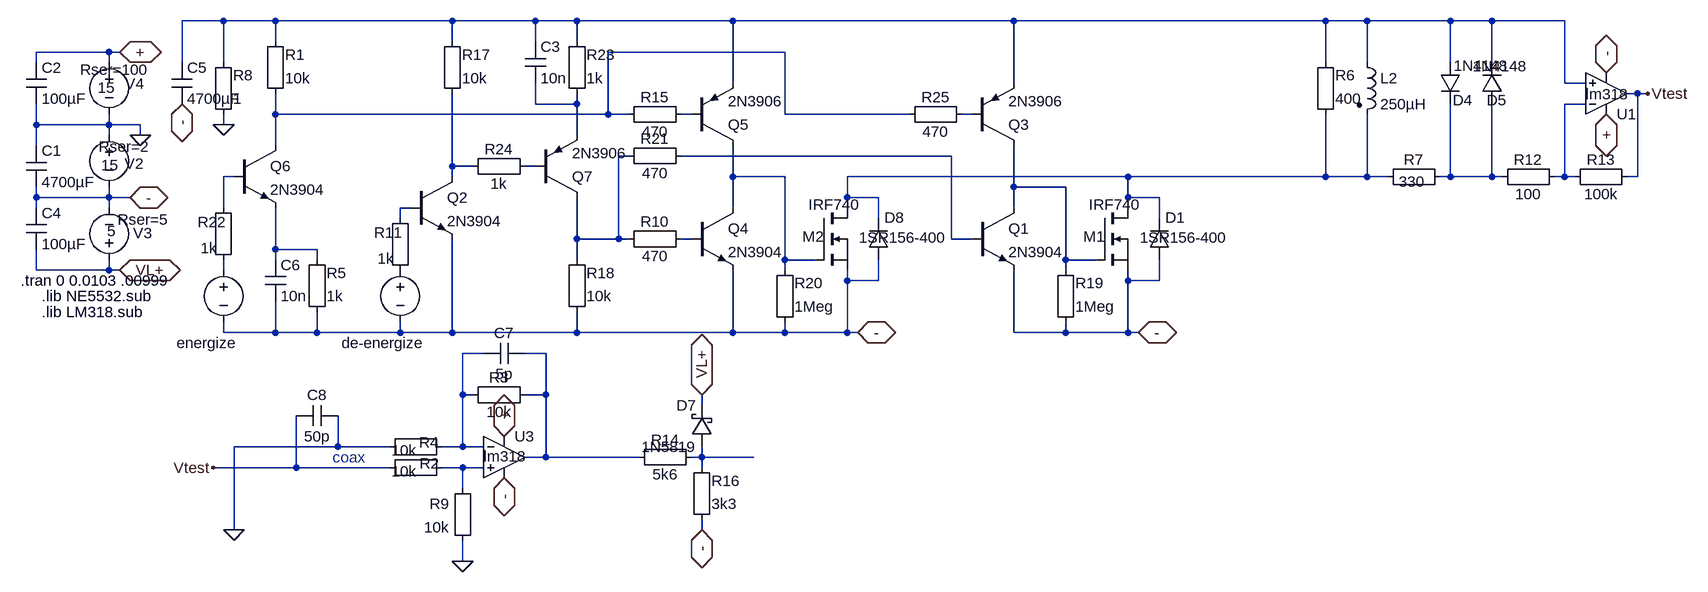
[diagram p0: schematic metal_low_power_fast_switch_4080.asc]
metal_low_power_fast_switch_4080.asc, the LTspice schematic file:
Version 4
SHEET 1 6068 1612
WIRE 96 -2400 32 -2400
WIRE 176 -2400 96 -2400
WIRE 448 -2400 176 -2400
WIRE 576 -2400 448 -2400
WIRE 640 -2400 576 -2400
WIRE 880 -2400 640 -2400
WIRE 1312 -2400 880 -2400
WIRE 1792 -2400 1312 -2400
WIRE 1856 -2400 1792 -2400
WIRE 1984 -2400 1856 -2400
WIRE 2048 -2400 1984 -2400
WIRE 2160 -2400 2048 -2400
WIRE 176 -2368 176 -2400
WIRE 448 -2368 448 -2400
WIRE 576 -2368 576 -2400
WIRE 640 -2368 640 -2400
WIRE -80 -2352 -192 -2352
WIRE -64 -2352 -80 -2352
WIRE 960 -2352 688 -2352
WIRE -192 -2336 -192 -2352
WIRE -80 -2336 -80 -2352
WIRE 32 -2336 32 -2400
WIRE 96 -2336 96 -2400
WIRE 1792 -2336 1792 -2400
WIRE 1856 -2336 1856 -2400
WIRE 1984 -2336 1984 -2400
WIRE 2048 -2336 2048 -2400
WIRE 880 -2304 880 -2400
WIRE 1312 -2304 1312 -2400
WIRE 2160 -2304 2160 -2400
WIRE 2192 -2304 2160 -2304
WIRE 2272 -2288 2256 -2288
WIRE 2288 -2288 2272 -2288
WIRE 576 -2272 576 -2304
WIRE 640 -2272 640 -2288
WIRE 640 -2272 576 -2272
WIRE 2192 -2272 2160 -2272
WIRE 176 -2256 176 -2288
WIRE 688 -2256 688 -2352
WIRE 688 -2256 176 -2256
WIRE 720 -2256 688 -2256
WIRE 816 -2256 800 -2256
WIRE 960 -2256 960 -2352
WIRE 1152 -2256 960 -2256
WIRE 1248 -2256 1232 -2256
WIRE -192 -2240 -192 -2272
WIRE -80 -2240 -80 -2256
WIRE -80 -2240 -192 -2240
WIRE -32 -2240 -80 -2240
WIRE 96 -2240 96 -2256
WIRE -80 -2224 -80 -2240
WIRE -32 -2224 -32 -2240
WIRE 640 -2224 640 -2272
WIRE -192 -2208 -192 -2240
WIRE 176 -2208 176 -2256
WIRE 720 -2192 704 -2192
WIRE 1216 -2192 800 -2192
WIRE 448 -2176 448 -2288
WIRE 480 -2176 448 -2176
WIRE 576 -2176 560 -2176
WIRE 112 -2160 96 -2160
WIRE 448 -2160 448 -2176
WIRE 880 -2160 880 -2208
WIRE 960 -2160 880 -2160
WIRE 1488 -2160 1056 -2160
WIRE 1792 -2160 1792 -2256
WIRE 1792 -2160 1488 -2160
WIRE 1856 -2160 1856 -2256
WIRE 1856 -2160 1792 -2160
WIRE 1888 -2160 1856 -2160
WIRE 1984 -2160 1984 -2272
WIRE 1984 -2160 1968 -2160
WIRE 2048 -2160 2048 -2272
WIRE 2048 -2160 1984 -2160
WIRE 2064 -2160 2048 -2160
WIRE 2160 -2160 2160 -2272
WIRE 2160 -2160 2144 -2160
WIRE 2176 -2160 2160 -2160
WIRE 2272 -2160 2272 -2288
WIRE 2272 -2160 2256 -2160
WIRE 1312 -2144 1312 -2208
WIRE 1392 -2144 1312 -2144
WIRE -192 -2128 -192 -2144
WIRE -80 -2128 -80 -2144
WIRE -80 -2128 -192 -2128
WIRE -48 -2128 -80 -2128
WIRE 1056 -2128 1056 -2160
WIRE 1104 -2128 1056 -2128
WIRE 1488 -2128 1488 -2160
WIRE 1536 -2128 1488 -2128
WIRE -192 -2112 -192 -2128
WIRE -80 -2112 -80 -2128
WIRE 96 -2112 96 -2160
WIRE 384 -2112 368 -2112
WIRE 880 -2112 880 -2160
WIRE 1056 -2112 1056 -2128
WIRE 1312 -2112 1312 -2144
WIRE 1488 -2112 1488 -2128
WIRE 368 -2096 368 -2112
WIRE 1104 -2096 1104 -2128
WIRE 1536 -2096 1536 -2128
WIRE 640 -2064 640 -2128
WIRE 704 -2064 704 -2192
WIRE 704 -2064 640 -2064
WIRE 720 -2064 704 -2064
WIRE 816 -2064 800 -2064
WIRE 1216 -2064 1216 -2192
WIRE 1248 -2064 1216 -2064
WIRE 176 -2048 176 -2112
WIRE 240 -2048 176 -2048
WIRE 176 -2032 176 -2048
WIRE 240 -2032 240 -2048
WIRE 640 -2032 640 -2064
WIRE 960 -2032 960 -2160
WIRE 1008 -2032 960 -2032
WIRE 1392 -2032 1392 -2144
WIRE 1440 -2032 1392 -2032
WIRE -192 -2016 -192 -2048
WIRE -80 -2016 -80 -2032
WIRE -80 -2016 -192 -2016
WIRE -64 -2016 -80 -2016
WIRE 96 -2016 96 -2032
WIRE 960 -2016 960 -2032
WIRE 1392 -2016 1392 -2032
WIRE 1056 -2000 1056 -2016
WIRE 1104 -2000 1104 -2032
WIRE 1104 -2000 1056 -2000
WIRE 1488 -2000 1488 -2016
WIRE 1536 -2000 1536 -2032
WIRE 1536 -2000 1488 -2000
WIRE 96 -1920 96 -1936
WIRE 176 -1920 176 -1968
WIRE 176 -1920 96 -1920
WIRE 240 -1920 240 -1952
WIRE 240 -1920 176 -1920
WIRE 368 -1920 368 -1936
WIRE 368 -1920 240 -1920
WIRE 448 -1920 448 -2064
WIRE 448 -1920 368 -1920
WIRE 640 -1920 640 -1952
WIRE 640 -1920 448 -1920
WIRE 880 -1920 880 -2016
WIRE 880 -1920 640 -1920
WIRE 960 -1920 960 -1936
WIRE 960 -1920 880 -1920
WIRE 1056 -1920 1056 -2000
WIRE 1056 -1920 960 -1920
WIRE 1072 -1920 1056 -1920
WIRE 1312 -1920 1312 -2016
WIRE 1392 -1920 1392 -1936
WIRE 1392 -1920 1312 -1920
WIRE 1488 -1920 1488 -2000
WIRE 1488 -1920 1392 -1920
WIRE 1504 -1920 1488 -1920
WIRE 496 -1888 464 -1888
WIRE 592 -1888 560 -1888
WIRE 464 -1824 464 -1888
WIRE 480 -1824 464 -1824
WIRE 592 -1824 592 -1888
WIRE 592 -1824 560 -1824
WIRE 832 -1808 832 -1824
WIRE 272 -1744 272 -1792
WIRE 272 -1744 112 -1744
WIRE 352 -1744 272 -1744
WIRE 464 -1744 464 -1824
WIRE 464 -1744 432 -1744
WIRE 496 -1744 464 -1744
WIRE 592 -1728 592 -1824
WIRE 592 -1728 560 -1728
WIRE 736 -1728 592 -1728
WIRE 832 -1728 832 -1744
WIRE 832 -1728 816 -1728
WIRE 912 -1728 832 -1728
WIRE 208 -1712 208 -1792
WIRE 208 -1712 80 -1712
WIRE 352 -1712 208 -1712
WIRE 464 -1712 432 -1712
WIRE 496 -1712 464 -1712
WIRE 832 -1712 832 -1728
WIRE 464 -1680 464 -1712
WIRE 112 -1616 112 -1744
WIRE 832 -1616 832 -1632
WIRE 464 -1568 464 -1600
FLAG -48 -2128 -
IOPIN -48 -2128 BiDir
FLAG -64 -2352 +
IOPIN -64 -2352 BiDir
FLAG -32 -2224 0
FLAG -64 -2016 VL+
IOPIN -64 -2016 BiDir
FLAG 32 -2272 -
IOPIN 32 -2272 BiDir
FLAG 96 -2240 0
FLAG 2224 -2256 +
IOPIN 2224 -2256 BiDir
FLAG 2224 -2320 -
IOPIN 2224 -2320 BiDir
FLAG 832 -1616 -
IOPIN 832 -1616 BiDir
FLAG 832 -1824 VL+
IOPIN 832 -1824 BiDir
FLAG 1072 -1920 -
IOPIN 1072 -1920 BiDir
FLAG 528 -1760 +
IOPIN 528 -1760 BiDir
FLAG 528 -1696 -
IOPIN 528 -1696 BiDir
FLAG 2288 -2288 Vtest
FLAG 80 -1712 Vtest
FLAG 464 -1568 0
FLAG 112 -1616 0
FLAG 1504 -1920 -
IOPIN 1504 -1920 BiDir
SYMBOL voltage -80 -2240 M0
WINDOW 123 0 0 Left 2
WINDOW 39 -63 34 Left 2
WINDOW 0 -53 60 Left 2
WINDOW 3 -15 62 Left 2
SYMATTR SpiceLine Rser=2
SYMATTR InstName V2
SYMATTR Value 15
SYMBOL voltage -80 -2352 M0
WINDOW 123 0 0 Left 2
WINDOW 39 -61 27 Left 2
WINDOW 0 -54 49 Left 2
WINDOW 3 -9 55 Left 2
SYMATTR SpiceLine Rser=100
SYMATTR InstName V4
SYMATTR Value 15
SYMBOL voltage -80 -2016 M180
WINDOW 123 0 0 Left 2
WINDOW 39 13 78 Left 2
WINDOW 0 37 57 Left 2
WINDOW 3 -3 60 Left 2
SYMATTR SpiceLine Rser=5
SYMATTR InstName V3
SYMATTR Value 5
SYMBOL Misc\\EuropeanCap -208 -2208 R0
SYMATTR InstName C1
SYMATTR Value 4700µF
SYMATTR SpiceLine V=400 Irms=1 Rser=.32 Lser=0
SYMBOL Misc\\EuropeanCap -208 -2336 R0
SYMATTR InstName C2
SYMATTR Value 100µF
SYMATTR SpiceLine V=400 Irms=1 Rser=.32 Lser=0
SYMBOL Misc\\EuropeanCap -208 -2112 R0
SYMATTR InstName C4
SYMATTR Value 100µF
SYMATTR SpiceLine V=400 Irms=1 Rser=.32 Lser=0
SYMBOL Misc\\EuropeanCap 16 -2336 R0
SYMATTR InstName C5
SYMATTR Value 4700µF
SYMATTR SpiceLine V=400 Irms=1 Rser=.32 Lser=0
SYMBOL ind2 1840 -2352 R0
SYMATTR InstName L2
SYMATTR Value 250µH
SYMATTR SpiceLine Rser=.5 Cpar=20p
SYMATTR Type ind
SYMBOL Misc\\EuropeanResistor 1776 -2240 M180
WINDOW 0 31 76 Left 2
WINDOW 3 31 40 Left 2
SYMATTR InstName R6
SYMATTR Value 400
SYMBOL Misc\\EuropeanResistor 1872 -2176 M90
WINDOW 0 5 56 VBottom 2
WINDOW 3 8 53 VTop 2
SYMATTR InstName R7
SYMATTR Value 330
SYMBOL diode 1968 -2336 R0
WINDOW 3 21 5 Left 2
WINDOW 0 20 58 Left 2
SYMATTR Value 1N4148
SYMATTR InstName D4
SYMBOL diode 2064 -2272 R180
WINDOW 0 -7 6 Left 2
WINDOW 3 -39 58 Left 2
SYMATTR InstName D5
SYMATTR Value 1N4148
SYMBOL Misc\\EuropeanResistor 80 -2240 M180
WINDOW 0 31 76 Left 2
WINDOW 3 31 40 Left 2
SYMATTR InstName R8
SYMATTR Value 1
SYMBOL nmos 1008 -2112 R0
WINDOW 0 -21 44 Left 2
WINDOW 3 -12 -5 Left 2
SYMATTR InstName M2
SYMATTR Value IRF740
SYMBOL voltage 368 -2032 M0
WINDOW 0 -38 128 Left 2
WINDOW 3 -134 119 Invisible 2
WINDOW 123 0 0 Left 2
SYMATTR InstName de-energize
SYMATTR Value PULSE(0 4.8 .01011 0 0 .000002 .01 1000)
SYMATTR SpiceLine Rser=0
SYMBOL npn3 384 -2160 R0
SYMATTR InstName Q2
SYMATTR Value 2N3904
SYMBOL Misc\\EuropeanResistor 352 -2000 M180
WINDOW 0 -24 74 Left 2
WINDOW 3 -19 34 Left 2
SYMATTR InstName R11
SYMATTR Value 1k
SYMBOL Opamps\\opamp2 2224 -2224 M180
WINDOW 3 -32 63 Left 2
SYMATTR Value lm318
SYMATTR InstName U1
SYMBOL Misc\\EuropeanResistor 2048 -2144 R270
WINDOW 0 27 56 VTop 2
WINDOW 3 5 56 VBottom 2
SYMATTR InstName R12
SYMATTR Value 100
SYMBOL Misc\\EuropeanResistor 2160 -2144 R270
WINDOW 0 27 56 VTop 2
WINDOW 3 5 56 VBottom 2
SYMATTR InstName R13
SYMATTR Value 100k
SYMBOL Misc\\EuropeanResistor 720 -1712 R270
WINDOW 0 27 56 VTop 2
WINDOW 3 5 56 VBottom 2
SYMATTR InstName R14
SYMATTR Value 5k6
SYMBOL Misc\\EuropeanResistor 816 -1616 M180
WINDOW 0 31 76 Left 2
WINDOW 3 31 40 Left 2
SYMATTR InstName R16
SYMATTR Value 3k3
SYMBOL schottky 848 -1744 R180
WINDOW 0 24 64 Left 2
WINDOW 3 24 0 Left 2
SYMATTR InstName D7
SYMATTR Value 1N5819
SYMATTR Description Diode
SYMATTR Type diode
SYMBOL npn3 816 -2112 R0
SYMATTR InstName Q4
SYMATTR Value 2N3904
SYMBOL diode 1120 -2032 R180
WINDOW 0 -24 65 Left 2
WINDOW 3 -90 34 Left 2
SYMATTR InstName D8
SYMATTR Value 1SR156-400
SYMATTR Description Zener Diode
SYMATTR Type zener
SYMBOL pnp2 816 -2208 M180
SYMATTR InstName Q5
SYMATTR Value 2N3906
SYMBOL Misc\\EuropeanResistor 944 -1920 M180
WINDOW 0 31 76 Left 2
WINDOW 3 31 40 Left 2
SYMATTR InstName R20
SYMATTR Value 1Meg
SYMBOL voltage 96 -2032 M0
WINDOW 0 -21 128 Left 2
WINDOW 3 -134 119 Invisible 2
WINDOW 123 0 0 Left 2
SYMATTR InstName energize
SYMATTR Value PULSE(0 4.8 .01 0 0 .0000021 .01 1000)
SYMATTR SpiceLine Rser=0
SYMBOL npn3 112 -2208 R0
SYMATTR InstName Q6
SYMATTR Value 2N3904
SYMBOL Misc\\EuropeanResistor 80 -2016 M180
WINDOW 0 -24 74 Left 2
WINDOW 3 -19 34 Left 2
SYMATTR InstName R22
SYMATTR Value 1k
SYMBOL pnp2 576 -2128 M180
SYMATTR InstName Q7
SYMATTR Value 2N3906
SYMBOL Misc\\EuropeanResistor 624 -2272 M180
WINDOW 0 31 76 Left 2
WINDOW 3 31 40 Left 2
SYMATTR InstName R23
SYMATTR Value 1k
SYMBOL Misc\\EuropeanResistor 464 -2192 M90
WINDOW 0 5 56 VBottom 2
WINDOW 3 27 56 VTop 2
SYMATTR InstName R24
SYMATTR Value 1k
SYMBOL Opamps\\opamp2 528 -1792 R0
WINDOW 3 -32 63 Left 2
SYMATTR Value lm318
SYMATTR InstName U3
SYMBOL Misc\\EuropeanResistor 464 -1840 M90
WINDOW 0 5 56 VBottom 2
WINDOW 3 27 56 VTop 2
SYMATTR InstName R3
SYMATTR Value 10k
SYMBOL Misc\\EuropeanCap 560 -1872 M270
WINDOW 0 32 32 VTop 2
WINDOW 3 0 32 VBottom 2
SYMATTR InstName C7
SYMATTR Value 5p
SYMATTR SpiceLine V=400 Irms=1 Rser=.32 Lser=0
SYMBOL Misc\\EuropeanCap 272 -1776 M270
WINDOW 0 32 32 VTop 2
WINDOW 3 0 32 VBottom 2
SYMATTR InstName C8
SYMATTR Value 50p
SYMATTR SpiceLine V=400 Irms=1 Rser=.32 Lser=0
SYMBOL Misc\\EuropeanResistor 336 -1728 M90
WINDOW 0 25 77 VBottom 2
WINDOW 3 6 38 VTop 2
SYMATTR InstName R2
SYMATTR Value 10k
SYMBOL Misc\\EuropeanResistor 480 -1696 M0
SYMATTR InstName R9
SYMATTR Value 10k
SYMBOL Misc\\EuropeanResistor 336 -1760 M90
WINDOW 0 25 76 VBottom 2
WINDOW 3 6 38 VTop 2
SYMATTR InstName R4
SYMATTR Value 10k
SYMBOL Misc\\EuropeanCap 560 -2368 R0
SYMATTR InstName C3
SYMATTR Value 10n
SYMATTR SpiceLine V=400 Irms=1 Rser=.32 Lser=0
SYMBOL Misc\\EuropeanResistor 224 -1936 M180
WINDOW 0 31 76 Left 2
WINDOW 3 31 40 Left 2
SYMATTR InstName R5
SYMATTR Value 1k
SYMBOL Misc\\EuropeanCap 160 -2032 R0
SYMATTR InstName C6
SYMATTR Value 10n
SYMATTR SpiceLine V=400 Irms=1 Rser=.32 Lser=0
SYMBOL Misc\\EuropeanResistor 816 -2048 M270
WINDOW 0 27 56 VTop 2
WINDOW 3 5 56 VBottom 2
SYMATTR InstName R10
SYMATTR Value 470
SYMBOL Misc\\EuropeanResistor 704 -2272 M90
WINDOW 0 5 56 VBottom 2
WINDOW 3 27 56 VTop 2
SYMATTR InstName R15
SYMATTR Value 470
SYMBOL Misc\\EuropeanResistor 160 -2272 M180
WINDOW 0 31 76 Left 2
WINDOW 3 31 40 Left 2
SYMATTR InstName R1
SYMATTR Value 10k
SYMBOL Misc\\EuropeanResistor 432 -2272 M180
WINDOW 0 31 76 Left 2
WINDOW 3 31 40 Left 2
SYMATTR InstName R17
SYMATTR Value 10k
SYMBOL Misc\\EuropeanResistor 624 -1936 M180
WINDOW 0 31 76 Left 2
WINDOW 3 31 40 Left 2
SYMATTR InstName R18
SYMATTR Value 10k
SYMBOL nmos 1440 -2112 R0
WINDOW 0 -21 44 Left 2
WINDOW 3 -12 -5 Left 2
SYMATTR InstName M1
SYMATTR Value IRF740
SYMBOL npn3 1248 -2112 R0
SYMATTR InstName Q1
SYMATTR Value 2N3904
SYMBOL diode 1552 -2032 R180
WINDOW 0 -24 65 Left 2
WINDOW 3 -90 34 Left 2
SYMATTR InstName D1
SYMATTR Value 1SR156-400
SYMATTR Description Zener Diode
SYMATTR Type zener
SYMBOL pnp2 1248 -2208 M180
SYMATTR InstName Q3
SYMATTR Value 2N3906
SYMBOL Misc\\EuropeanResistor 1376 -1920 M180
WINDOW 0 31 76 Left 2
WINDOW 3 31 40 Left 2
SYMATTR InstName R19
SYMATTR Value 1Meg
SYMBOL Misc\\EuropeanResistor 816 -2176 M270
WINDOW 0 27 56 VTop 2
WINDOW 3 5 56 VBottom 2
SYMATTR InstName R21
SYMATTR Value 470
SYMBOL Misc\\EuropeanResistor 1136 -2272 M90
WINDOW 0 5 56 VBottom 2
WINDOW 3 27 56 VTop 2
SYMATTR InstName R25
SYMATTR Value 470
TEXT -216 -2000 Left 2 !.tran 0 0.0103 .00999
TEXT -184 -1976 Left 2 !.lib NE5532.sub
TEXT -184 -1952 Left 2 !.lib LM318.sub
TEXT 264 -1728 Left 2 ;coax

The netlist it stands for:
* metal_low_power_fast_switch_4080.asc
V2 0 - 15 Rser=2
V4 + 0 15 Rser=100
V3 VL+ - 5 Rser=5
C1 0 - 4700µF V=400 Irms=1 Rser=.32 Lser=0
C2 + 0 100µF V=400 Irms=1 Rser=.32 Lser=0
C4 - VL+ 100µF V=400 Irms=1 Rser=.32 Lser=0
C5 N001 - 4700µF V=400 Irms=1 Rser=.32 Lser=0
L2 N001 N013 250µH Rser=.5 Cpar=20p
R6 N013 N001 400
R7 N013 N014 330
D4 N001 N014 1N4148
D5 N014 N001 1N4148
R8 0 N001 1
M2 N013 N012 - - IRF740
V§de-energize P001 - PULSE(0 4.8 .01011 0 0 .000002 .01 1000) Rser=0
Q2 N009 N016 - 0 2N3904
R11 P001 N016 1k
XU1 N001 N004 + - Vtest lm318  ; pins In+ In- V+ V- OUT
R12 N014 N004 100
R13 N004 Vtest 100k
R14 N021 N022 5k6
R16 - N022 3k3
D7 N022 VL+ 1N5819
Q4 N012 N017 - 0 2N3904
D8 - N013 1SR156-400
Q5 N012 N005 N001 0 2N3906
R20 - N012 1Meg
V§energize N019 - PULSE(0 4.8 .01 0 0 .0000021 .01 1000) Rser=0
Q6 N002 N011 N018 0 2N3904
R22 N019 N011 1k
Q7 N007 N010 N003 0 2N3906
R23 N003 N001 1k
R24 N009 N010 1k
XU3 N023 N020 + - N021 lm318  ; pins In+ In- V+ V- OUT
R3 N020 N021 10k
C7 N021 N020 5p V=400 Irms=1 Rser=.32 Lser=0
C8 0 Vtest 50p V=400 Irms=1 Rser=.32 Lser=0
R2 Vtest N023 10k
R9 N023 0 10k
R4 0 N020 10k
C3 N001 N003 10n V=400 Irms=1 Rser=.32 Lser=0
R5 - N018 1k
C6 N018 - 10n V=400 Irms=1 Rser=.32 Lser=0
R10 N017 N007 470
R15 N002 N005 470
R1 N002 N001 10k
R17 N009 N001 10k
R18 - N007 10k
M1 N013 N015 - - IRF740
Q1 N015 N008 - 0 2N3904
D1 - N013 1SR156-400
Q3 N015 N006 N001 0 2N3906
R19 - N015 1Meg
R21 N008 N007 470
R25 N002 N006 470
.model D D
.lib standard.dio
.model NPN NPN
.model PNP PNP
.lib standard.bjt
.model NMOS NMOS
.model PMOS PMOS
.lib standard.mos
.tran 0 0.0103 .00999
.lib NE5532.sub
.lib LM318.sub
* coax
.backanno
.end